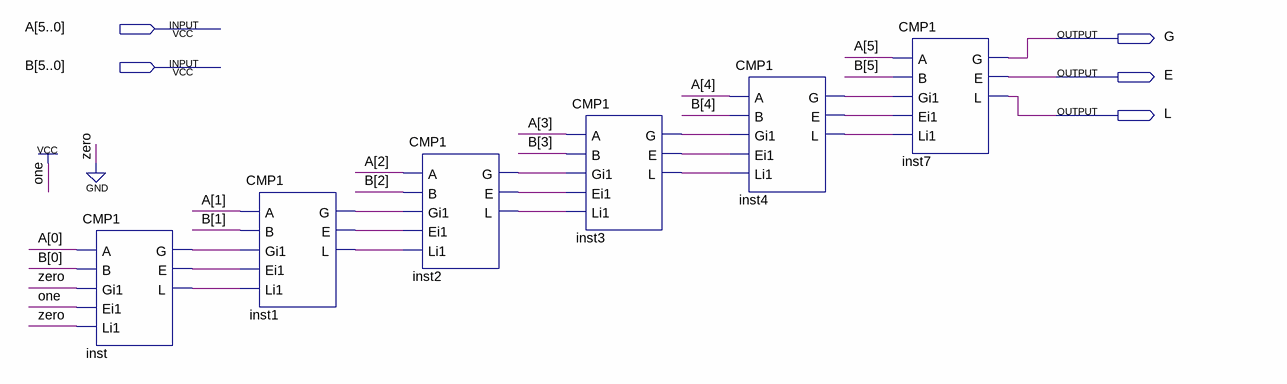
[diagram p0: schematic sheet]
// Quartus schematic CMP6.bdf as structural Verilog: 6 symbols, 5 pins
module CMP6 (
  input  [5:0] A,
  input  [5:0] B,
  output G,
  output E,
  output L
);

  wire inst1_e, inst1_g, inst1_l, inst2_e, inst2_g, inst2_l, inst3_e, inst3_g, inst3_l, inst4_e, inst4_g,
       inst4_l, inst_e, inst_g, inst_l;

  CMP1 inst (.A(A[0]), .B(B[0]), .Gi1(1'b0), .Ei1(1'b1), .Li1(1'b0), .G(inst_g), .E(inst_e), .L(inst_l));
  CMP1 inst1 (.A(A[1]), .B(B[1]), .Gi1(inst_g), .Ei1(inst_e), .Li1(inst_l), .G(inst1_g), .E(inst1_e), .L(inst1_l));
  CMP1 inst2 (.A(A[2]), .B(B[2]), .Gi1(inst1_g), .Ei1(inst1_e), .Li1(inst1_l), .G(inst2_g), .E(inst2_e), .L(inst2_l));
  CMP1 inst3 (.A(A[3]), .B(B[3]), .Gi1(inst2_g), .Ei1(inst2_e), .Li1(inst2_l), .G(inst3_g), .E(inst3_e), .L(inst3_l));
  CMP1 inst4 (.A(A[4]), .B(B[4]), .Gi1(inst3_g), .Ei1(inst3_e), .Li1(inst3_l), .G(inst4_g), .E(inst4_e), .L(inst4_l));
  CMP1 inst7 (.A(A[5]), .B(B[5]), .Gi1(inst4_g), .Ei1(inst4_e), .Li1(inst4_l), .G(G), .E(E), .L(L));
endmodule
